# Altium schematic sheet 1_V4.schdoc
size 431 x 309 mm; Symbol: Sheet-Symbol_A4; Device: Sheet-Symbol_A4; @Page Name: V4; @Create Date: 2023-07-20; @Page Count: 1; @Page No: 1; @Project Name: openIOT传感器; @Schematic Name: V4; @Update Date: 2023-07-20; Company: 嘉立创EDA; Page Size: A4; Version: V1.0
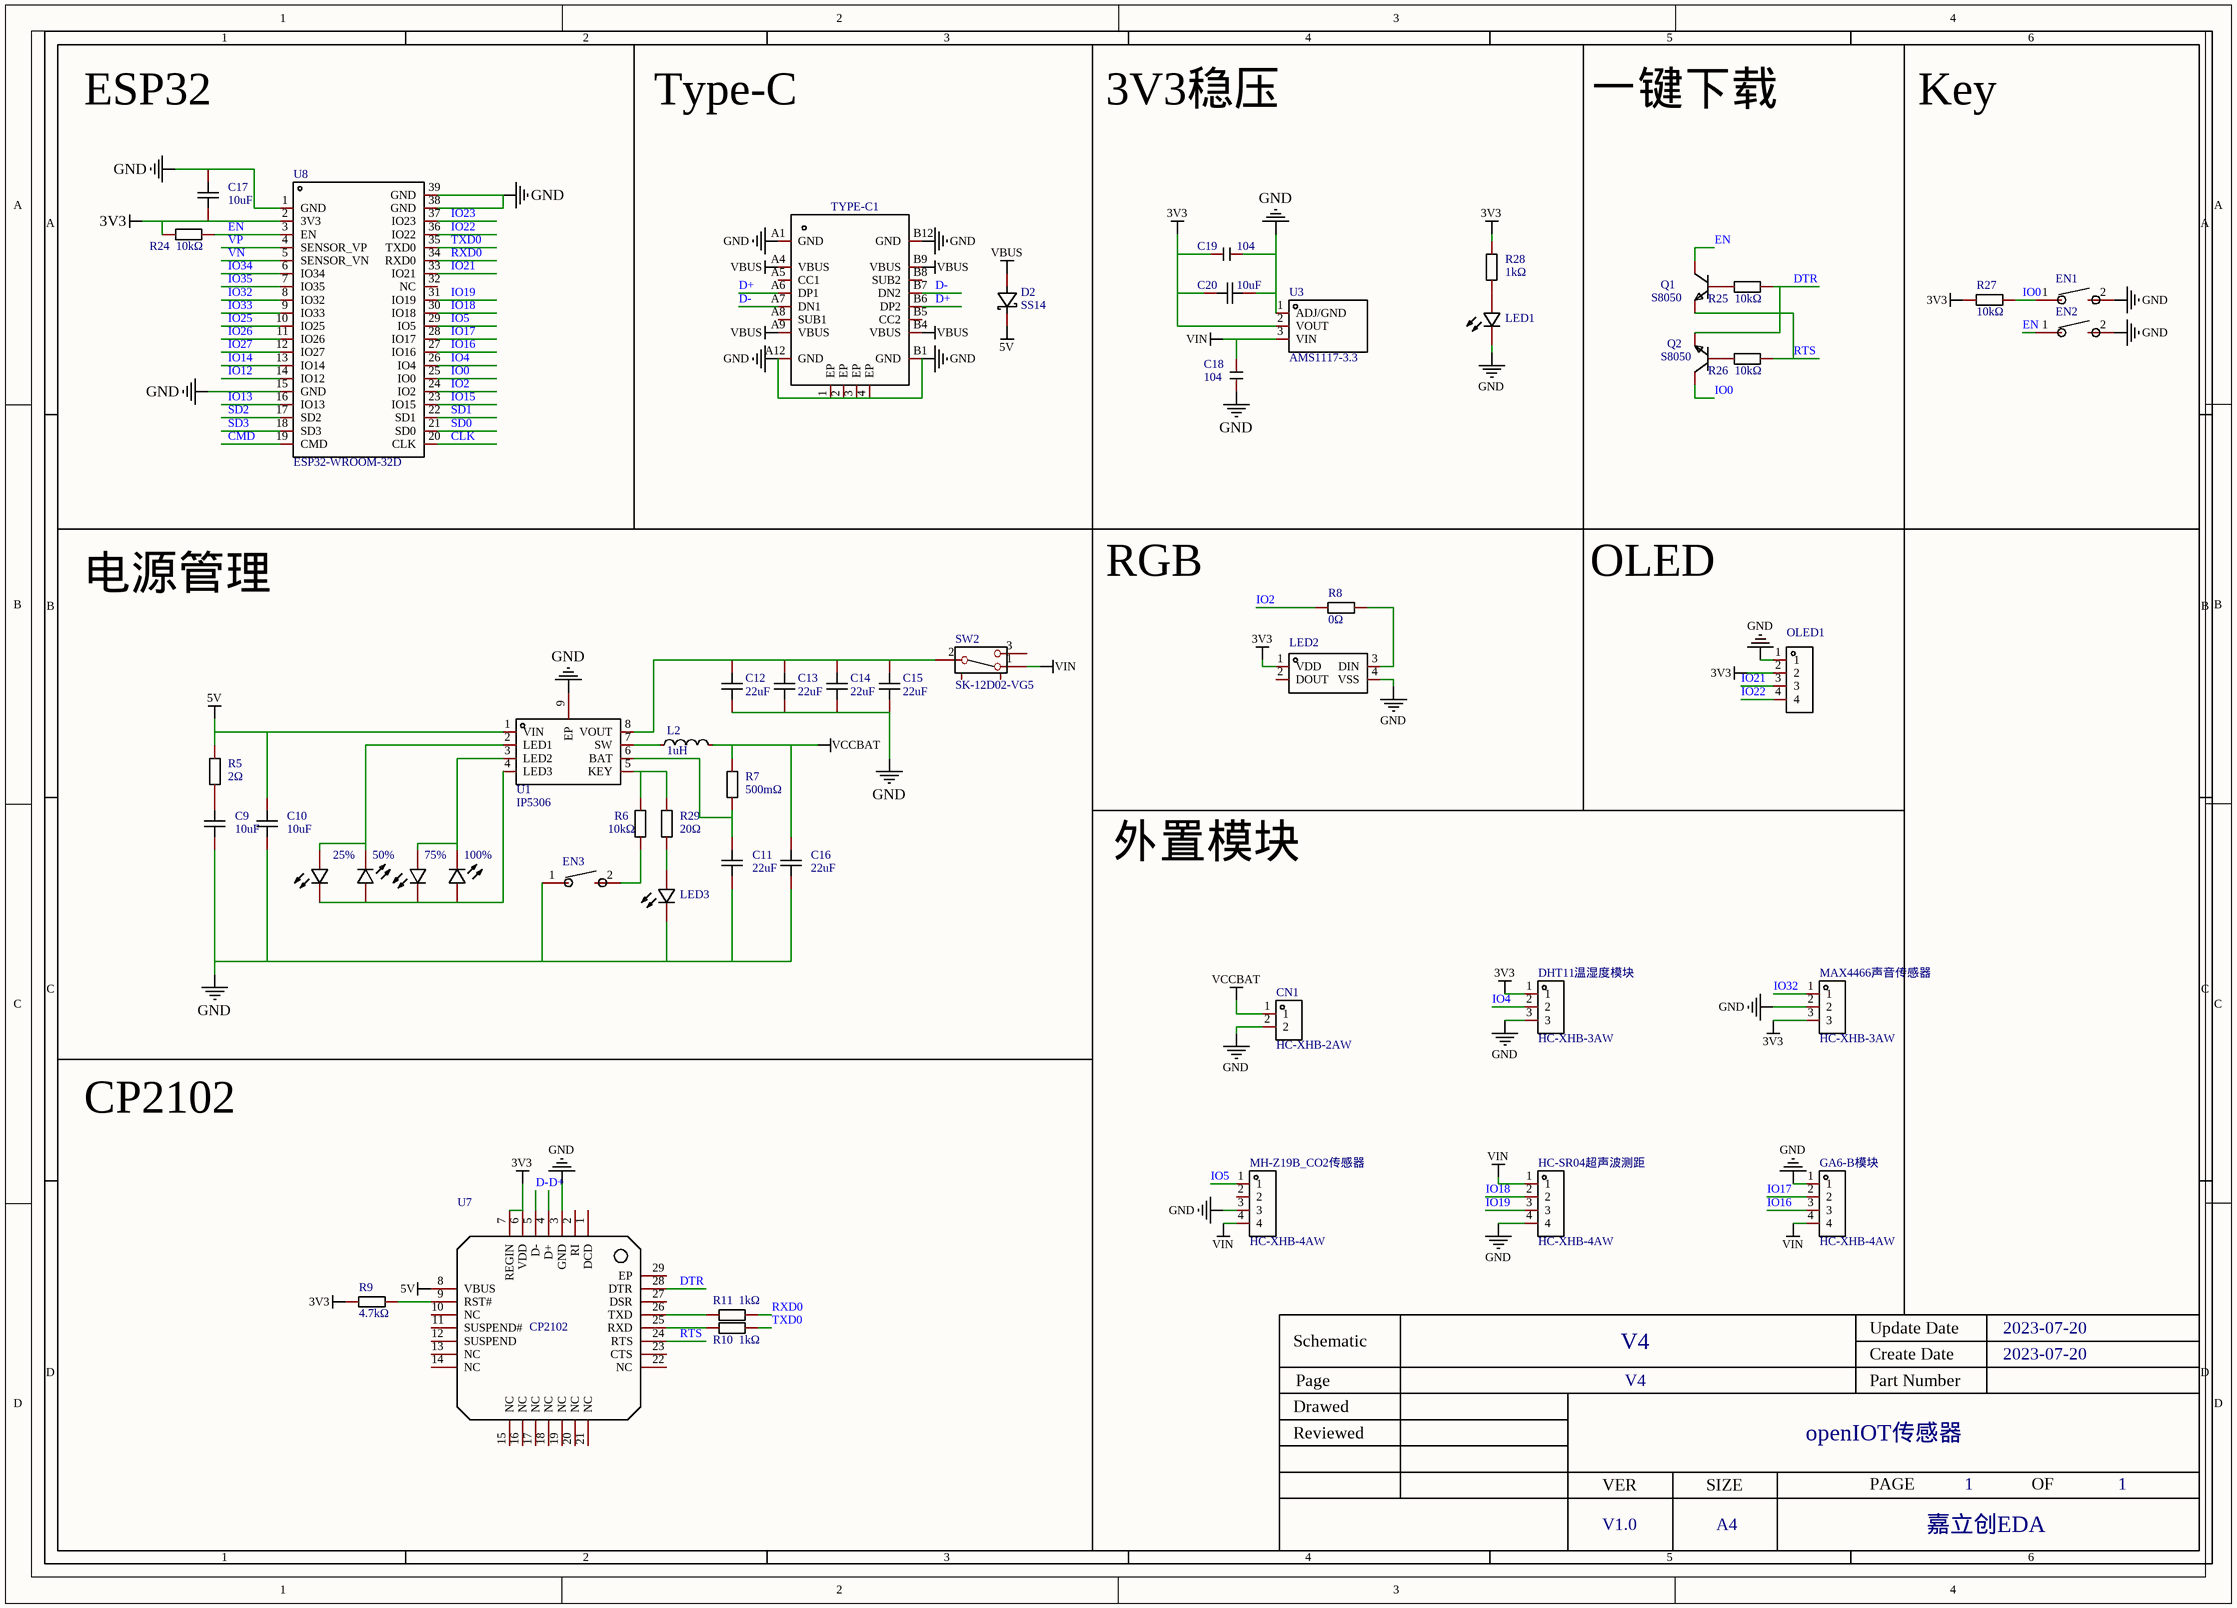
[diagram p0: 1_V4.schdoc]

## Parts
25%  19-217/GHC-YR1S2/3T  [LED0603-RD]  (value not drawn)
50%  19-217/GHC-YR1S2/3T  [LED0603-RD]  (value not drawn)
75%  19-217/GHC-YR1S2/3T  [LED0603-RD]  (value not drawn)
100%  19-217/GHC-YR1S2/3T  [LED0603-RD]  (value not drawn)
C9  10uF  [C0805]
C10  10uF  [C0805]
C11  22uF  [C1206]
C12  22uF  [C1206]
C13  22uF  [C1206]
C14  22uF  [C1206]
C15  22uF  [C1206]
C16  22uF  [C1206]
C17  10uF  [C0805]
C18  104  [C0603]
C19  104  [C0603]
C20  10uF  [C0805]
CN1  HC-XHB-2AW  [CONN-TH_2P-P2.50_HCTL_HC-XHB-2AW]
D2  SS14  [SOD-123FL_L2.8-W1.8-LS3.7-RD]
DHT11温湿度模块  HC-XHB-3AW  [CONN-TH_3P-HC-XHB-3AW]
EN1  TSA343G00-250J2  [SW-SMD_L4.0-W2.9-LS5.0]  (value not drawn)
EN2  TSA343G00-250J2  [SW-SMD_L4.0-W2.9-LS5.0]  (value not drawn)
EN3  TSA343G00-250J2  [SW-SMD_L4.0-W2.9-LS5.0]  (value not drawn)
GA6-B模块  HC-XHB-4AW  [CONN-TH_4P-P2.5_HCTL_HC-XHB-4AW]
HC-SR04超声波测距  HC-XHB-4AW  [CONN-TH_4P-P2.5_HCTL_HC-XHB-4AW]
L2  1uH  [IND-SMD_L7.0-W6.6]
LED1  19-217/GHC-YR1S2/3T  [LED0603-RD]  (value not drawn)
LED2  WS2812B-V5/W  [LED-SMD_L5.0-W5.0-P3.20-LS5.4-TL]  (value not drawn)
LED3  19-217/GHC-YR1S2/3T  [LED0603-RD]  (value not drawn)
MAX4466声音传感器  HC-XHB-3AW  [CONN-TH_3P-HC-XHB-3AW]
MH-Z19B_CO2传感器  HC-XHB-4AW  [CONN-TH_4P-P2.5_HCTL_HC-XHB-4AW]
OLED1  2.54-1*4P母  [HDR-TH_4P-P2.54-V-F]  (value not drawn)
Q1  S8050  [SOT-23-3_L2.9-W1.3-P1.90-LS2.4-BR]
Q2  S8050  [SOT-23-3_L2.9-W1.3-P1.90-LS2.4-BR]
R5  2Ω  [R0805]
R6  10kΩ  [R0805]
R7  500mΩ  [R1206]
R8  0Ω  [R0603]
R9  4.7kΩ  [R0603]
R10  1kΩ  [R0603]
R11  1kΩ  [R0603]
R24  10kΩ  [R0603]
R25  10kΩ  [R0603]
R26  10kΩ  [R0603]
R27  10kΩ  [R0603]
R28  1kΩ  [R0603]
R29  20Ω  [R0603]
SW2  SK-12D02-VG5  [SW-TH_SK-12D02-VG5]
TYPE-C1  KH-TYPE-C-16P  [USB-C-SMD_KH-TYPE-C-16P]  (value not drawn)
U1  IP5306  [ESOP-8_L4.9-W3.9-P1.27-LS6.0-BL-EP]
U3  AMS1117-3.3  [SOT-89-3_L4.5-W2.5-P1.50-LS4.2-BR]
U7  CP2102  [WQFN-28_L5.0-W5.0-P0.50-BL-EP3.2]
U8  ESP32-WROOM-32D  [WIFIM-SMD_ESP32-WROOM-32D]

## Nets
3V3: C17.1 C19.2 C20.2 DHT11温湿度模块.1 LED2.1(VDD) MAX4466声音传感器.3 OLED1.2 R9.1 R24.1 R27.2 R28.2 U3.2(VOUT) U7.6(VDD) U7.7(REGIN) U8.2(3V3)
5V: C10.2 D2.1(A) R5.2 U1.1(VIN) U7.8(VBUS)
GND: C9.1 C10.1 C11.1 C12.1 C13.1 C14.1 C15.1 C16.1 C17.2 C18.1 C19.1 C20.1 CN1.2 DHT11温湿度模块.3 EN1.2 EN2.2 EN3.1 GA6-B模块.1 HC-SR04超声波测距.4 LED1.1(C) LED2.4(VSS) LED3.1(C) MAX4466声音传感器.2 MH-Z19B_CO2传感器.3 OLED1.1 TYPE-C1.1(EP) TYPE-C1.2(EP) TYPE-C1.3(EP) TYPE-C1.4(EP) TYPE-C1.A1(GND) TYPE-C1.A12(GND) TYPE-C1.B1(GND) TYPE-C1.B12(GND) U1.9(EP) U3.1(ADJ/GND) U7.3(GND) U8.1(GND) U8.15(GND) U8.38(GND) U8.39(GND)
VBUS: D2.2(K) TYPE-C1.A4(VBUS) TYPE-C1.A9(VBUS) TYPE-C1.B4(VBUS) TYPE-C1.B9(VBUS)
VCCBAT: C16.2 CN1.1 L2.2 R7.2
VIN: C18.2 GA6-B模块.4 HC-SR04超声波测距.1 MH-Z19B_CO2传感器.4 SW2.1 U3.3(VIN)
CLK: U8.20(CLK)
CMD: U8.19(CMD)
D+: TYPE-C1.A6(DP1) TYPE-C1.B6(DP2) U7.4(D+)
D-: TYPE-C1.A7(DN1) TYPE-C1.B7(DN2) U7.5(D-)
DTR: Q2.2(E) R25.2 U7.28(DTR)
EN: EN2.1 Q1.3(C) R24.2 U8.3(EN)
IO0: EN1.1 Q2.3(C) R27.1 U8.25(IO0)
IO2: R8.2 U8.24(IO2)
IO4: DHT11温湿度模块.2 U8.26(IO4)
IO5: MH-Z19B_CO2传感器.1 U8.29(IO5)
IO12: U8.14(IO12)
IO13: U8.16(IO13)
IO14: U8.13(IO14)
IO15: U8.23(IO15)
IO16: GA6-B模块.3 U8.27(IO16)
IO17: GA6-B模块.2 U8.28(IO17)
IO18: HC-SR04超声波测距.2 U8.30(IO18)
IO19: HC-SR04超声波测距.3 U8.31(IO19)
IO21: OLED1.3 U8.33(IO21)
IO22: OLED1.4 U8.36(IO22)
IO23: U8.37(IO23)
IO25: U8.10(IO25)
IO26: U8.11(IO26)
IO27: U8.12(IO27)
IO32: MAX4466声音传感器.1 U8.8(IO32)
IO33: U8.9(IO33)
IO34: U8.6(IO34)
IO35: U8.7(IO35)
RTS: Q1.2(E) R26.2 U7.24(RTS)
RXD0: R11.2 U8.34(RXD0)
SD0: U8.21(SD0)
SD1: U8.22(SD1)
SD2: U8.17(SD2)
SD3: U8.18(SD3)
TXD0: R10.2 U8.35(TXD0)
VN: U8.5(SENSOR_VN)
VP: U8.4(SENSOR_VP)
Net25%_1: 25%.1(C) 50%.2(A) 75%.1(C) 100%.2(A) U1.4(LED3)
Net25%_2: 25%.2(A) 50%.1(C) U1.2(LED1)
Net75%_2: 75%.2(A) 100%.1(C) U1.3(LED2)
NetC9_2: C9.2 R5.1
NetC11_2: C11.2 R7.1 U1.6(BAT)
NetC12_2: C12.2 C13.2 C14.2 C15.2 SW2.2 U1.8(VOUT)
NetEN3_2: EN3.2 R6.1
NetL2_1: L2.1 U1.7(SW)
NetLED1_2: LED1.2(A) R28.1
NetLED2_3: LED2.3(DIN) R8.1
NetLED3_2: LED3.2(A) R29.1
NetQ1_1: Q1.1(B) R25.1
NetQ2_1: Q2.1(B) R26.1
NetR6_2: R6.2 R29.2 U1.5(KEY)
NetR9_2: R9.2 U7.9(RST#)
NetR10_1: R10.1 U7.25(RXD)
NetR11_1: R11.1 U7.26(TXD)

Not connected (* = marked no-connect by the designer): LED2 2(DOUT); MH-Z19B_CO2传感器 2; SW2 3 4 5; TYPE-C1 A5(CC1) A8(SUB1) B5(CC2) B8(SUB2); U7 1(DCD) 2(RI) 10(NC) 11(SUSPEND#) 12(SUSPEND) 13(NC) 14(NC) 15(NC) 16(NC) 17(NC) 18(NC) 19(NC) 20(NC) 21(NC) 22(NC) 23(CTS) 27(DSR) 29(EP); U8 32(NC)

## Notes on the sheet
- ESP32
- Type-C
- 3V3稳压
- 一键下载
- Key
- RGB
- OLED
- 电源管理
- 外置模块
- CP2102
- 1
- 2
- 3
- 4
- 5
- 6
- A
- B
- C
- D
- Schematic
- V4
- Create Date
- Update Date
- 2023-07-20
- Reviewed
- Drawed
- Page
- Part Number
- openIOT传感器
- VER
- SIZE
- PAGE
- OF
- V1.0
- A4
- 嘉立创EDA

## Library data of the parts
25% 50% 75% 100% LED1 LED3 = 19-217/GHC-YR1S2/3T: 发光颜色:翠绿;二极管配置:-;主波长:520nm~535nm;色温:-;功率:110mW;安装方式:-;; Manufacturer: EVERLIGHT(亿光); Add into BOM: yes; Emitted Color: 翠绿; Lens Color: 无色透明; Peak Wavelength: 518nm; Forward Current: 20mA; Power Dissipation: 110mW; Viewing Angle: 120°; Name: 19-217/GHC-YR1S2/3T; Symbol: 19-217/GHC-YR1S2/3T; Device: 19-217/GHC-YR1S2/3T; LCSC Part Name: 19-217/GHC-YR1S2/3T; Supplier Part: C72043; Manufacturer Part: 19-217/GHC-YR1S2/3T; Supplier Footprint: 0603; JLCPCB Part Class: Basic Part; Datasheet: https://atta.szlcsc.com/upload/public/pdf/source/20160507/1462613613780.pdf; Supplier: LCSC; Convert to PCB: yes; Diode Configuration: -; Dominant Wavelength: 520nm~535nm; Color Temperature: -; Mounting Sytle: -; Operating Temperature: -40℃~+85℃
C9 C10 C17 C20 = GRM21BR61H106KE43L: 容值:10uF;精度:±10%;额定电压:50V;材质(温度系数):X5R;; Manufacturer: muRata(村田); Add into BOM: yes; Tolerance: ±10%; Voltage Rated: 50V; Temperature Coefficient: X5R; Name: 10uF; Symbol: GRM21BR61H106KE43L; Device: GRM21BR61H106KE43L; LCSC Part Name: 10uF ±10% 50V; Supplier Part: C440198; Manufacturer Part: GRM21BR61H106KE43L; Supplier Footprint: 0805; JLCPCB Part Class: Basic Part; Datasheet: https://atta.szlcsc.com/upload/public/pdf/source/20191220/C440198_2DEA1B9834E321C8893F7972E9DFE5B0.pdf; Supplier: LCSC; Convert to PCB: yes; Value: 10uF
C11-C16 = C3216X5R1V226MTJ00E: 容值:22uF;精度:±20%;额定电压:35V;材质(温度系数):X5R;; Manufacturer: TDK; Add into BOM: yes; Tolerance: ±20%; Voltage Rated: 35V; Temperature Coefficient: X5R; Name: 22uF; Symbol: C3216X5R1V226MTJ00E; Device: C3216X5R1V226MTJ00E; LCSC Part Name: 22uF ±20% 35V; Supplier Part: C342620; Manufacturer Part: C3216X5R1V226MTJ00E; Supplier Footprint: 1206; JLCPCB Part Class: Extended Part; Datasheet: https://atta.szlcsc.com/upload/public/pdf/source/20190225/C342620_AEDAF1591EBCA53DD875EA2BBF91AE9A.pdf; Supplier: LCSC; Convert to PCB: yes; Value: 22uF
C18 C19 = 104: 3DModel: C0603_L1.6-W0.8-H0.8; BOM名称: 无极性贴片电容; 版权归属: 源创客; Add into BOM: yes; Name: 104; Symbol: 104; Device: 104; link: https://item.szlcsc.com/362304.html; 学习资源: www.ooocke.com; Convert to PCB: yes; Origin Footprint: C0603
CN1 = HC-XHB-2AW_C2845505: 参考系列:-;间距:2.5mm;插针结构:1x2P;排数:1;每排PIN数:2;行距:-;公母:公型插针;安装方式:弯插;额定电流:3A;工作温度范围:-25℃~+85℃;; Manufacturer: HCTL(华灿天禄); Add into BOM: yes; Pitch: 2.5mm; Pins Structure: 1x2P; Number of PINs Per Row: 2; Gender: 公型插针; Current Rating (Max): 3A; Name: HC-XHB-2AW; Symbol: HC-XHB-2AW; Device: HC-XHB-2AW_C2845505; LCSC Part Name: 2.54带锁扣卧式插件 2P 针座连接器线对板/线对线连接器; Supplier Part: C2845505; Manufacturer Part: HC-XHB-2AW; Supplier Footprint: 弯插,P=2.5mm; JLCPCB Part Class: Extended Part; Datasheet: https://atta.szlcsc.com/upload/public/pdf/source/20210729/C2845505_EFBF7AEAA36C6A5A1E79F7933436620E.pdf; Supplier: LCSC; Convert to PCB: yes; Reference Series: -; Number of Rows: 1; Row Spacing: -; Mounting Style: 弯插; Operating Temperature Range: -25℃~+85℃
D2 = SS14_C2909920: 二极管配置:-;直流反向耐压(Vr):40V;平均整流电流(Io):1A;正向压降(Vf):550mV@1A;反向电流(Ir):500uA@40V;; Manufacturer: KUU; Add into BOM: yes; Reverse Voltage (Vr): 40V; Average Rectified Current (Io): 1A; Name: SS14; Symbol: SS14_C2909920; Device: SS14_C2909920; LCSC Part Name: 40V 1A 550mV@1A; Supplier Part: C2909920; Manufacturer Part: SS14; Supplier Footprint: SOD-123FL; JLCPCB Part Class: Extended Part; Datasheet: https://atta.szlcsc.com/upload/public/pdf/source/20211028/6407406DF6AAB99A3E103CB6CA1E22D5.pdf; Supplier: LCSC; Convert to PCB: yes; Diode Configuration: -; Forward Voltage (Vf@If): 550mV@1A; Reverse Leakage Current (Ir): 500uA@40V
DHT11温湿度模块 MAX4466声音传感器 = HC-XHB-3AW_C2845506: 参考系列:-;间距:2.5mm;插针结构:1x3P;排数:1;每排PIN数:3;行距:-;公母:公型插针;安装方式:弯插;额定电流:3A;工作温度范围:-25℃~+85℃;; Manufacturer: HCTL(华灿天禄); Add into BOM: yes; Pitch: 2.5mm; Pins Structure: 1x3P; Number of PINs Per Row: 3; Gender: 公型插针; Current Rating (Max): 3A; Name: HC-XHB-3AW; Symbol: HC-XHB-3AW; Device: HC-XHB-3AW_C2845506; LCSC Part Name: 2.54带锁扣卧式插件 3P 针座连接器线对板/线对线连接器; Supplier Part: C2845506; Manufacturer Part: HC-XHB-3AW; Supplier Footprint: 弯插,P=2.5mm; JLCPCB Part Class: Extended Part; Datasheet: https://atta.szlcsc.com/upload/public/pdf/source/20210729/C2845505_EFBF7AEAA36C6A5A1E79F7933436620E.pdf; Supplier: LCSC; Convert to PCB: yes; Reference Series: -; Number of Rows: 1; Row Spacing: -; Mounting Style: 弯插; Operating Temperature Range: -25℃~+85℃
EN1-EN3 = TSA343G00-250J2: 触点电流:50mA;额定电压(DC):12V;绝缘电阻:100MΩ;电路结构:单刀单掷;安装方式:立贴;按钮形状:圆形按钮;按钮/盖帽颜色:黑色;带灯:无;作用力:250gf@±50gf;机械寿命:50000;工作温度:-25℃~+70℃;引脚样式:SMD接片;开关长度:3.95mm;开关宽度:2.9mm;开关高度:2mm;带支架:否;; Manufacturer: BRIGHT(博瑞泰); Add into BOM: yes; Contact Current: 50mA; Voltage Rating (DC): 12V; Insulation Resistance: 100MΩ; Circuit: 单刀单掷; Actuator Style: 圆形按钮; Actuator/Cap Color: 黑色; With Lamp: 无; Mechanical Life: 50000; Pin Style: SMD接片; Switch Length: 3.95mm; Switch Width: 2.9mm; Switch Height: 2mm; Strike Gundam: 否; Actuator Orientation: 顶部触动; 3DModel: SW-SMD_L4.0-W2.9-H2-P4.15-EH; Paste Type: expand; Origin Footprint: SW-SMD_L4.0-W2.9-P4.15-EH; Name: TSA343G00-250J2; Symbol: TSA343G00-250J2; Device: TSA343G00-250J2; LCSC Part Name: 3*4 两脚小龟不带柱  250gf; Supplier Part: C354946; Manufacturer Part: TSA343G00-250J2; Supplier Footprint: SMD; JLCPCB Part Class: Extended Part; Datasheet: https://atta.szlcsc.com/upload/public/pdf/source/20190426/C354946_6B70DFBDFA823D17B8EB46FB9599F693.pdf; Supplier: LCSC; Convert to PCB: yes; Mounting Style: 立贴; Operating Force: 250gf@±50gf; Operating Temperature: -25℃~+70℃; Illumination Color: -; link: https://item.szlcsc.com/457634.html; Assembly Type: smtWeld
GA6-B模块 HC-SR04超声波测距 MH-Z19B_CO2传感器 = HC-XHB-4AW: 参考系列:-;间距:2.5mm;插针结构:1x4P;排数:1;每排PIN数:4;行距:-;公母:公型插针;安装方式:弯插;额定电流:3A;工作温度范围:-25℃~+85℃;; Manufacturer: HCTL(华灿天禄); Add into BOM: yes; Pitch: 2.5mm; Pins Structure: 1x4P; Number of PINs Per Row: 4; Gender: 公型插针; Current Rating (Max): 3A; Name: HC-XHB-4AW; Symbol: HC-XHB-4AW; Device: HC-XHB-4AW; LCSC Part Name: 2.54带锁扣卧式插件 4P 针座连接器线对板/线对线连接器; Supplier Part: C2845507; Manufacturer Part: HC-XHB-4AW; Supplier Footprint: 弯插,P=2.5mm; JLCPCB Part Class: Extended Part; Datasheet: https://atta.szlcsc.com/upload/public/pdf/source/20210729/C2845505_EFBF7AEAA36C6A5A1E79F7933436620E.pdf; Supplier: LCSC; Convert to PCB: yes; Reference Series: -; Number of Rows: 1; Row Spacing: -; Mounting Style: 弯插; Operating Temperature Range: -25℃~+85℃
L2 = FXL0618-1R0-M: 电感值:1uH;精度:±20%;额定电流:8.5A;饱和电流(Isat):14A;; Manufacturer: cjiang(长江微电); Add into BOM: yes; Tolerance: ±20%; Rated Current: 8.5A; Saturation Current (Isat): 14A; DC Resistance (DCR): 13mΩ; Name: 1uH; Symbol: FXL0618-1R0-M; Device: FXL0618-1R0-M; LCSC Part Name: 1uH ±20% 8.5A 13mΩ; Supplier Part: C524591; Manufacturer Part: FXL0618-1R0-M; Supplier Footprint: SMD,6.6x7mm; JLCPCB Part Class: Extended Part; Datasheet: https://atta.szlcsc.com/upload/public/pdf/source/20200117/C485363_A2440626DC7482D75DD0DD56D1883FBF.pdf; Supplier: LCSC; Convert to PCB: yes; Value: 1uH
LED2 = WS2812B-V5/W: Manufacturer: worldsemi; Add into BOM: yes; Name: WS2812B-V5/W; Symbol: WS2812B-V5/W; Device: WS2812B-V5/W; LCSC Part Name: RGB三色 （注意防潮，请查阅规格书中对应具体内容）; Supplier Part: C2874885; Manufacturer Part: WS2812B-V5/W; Supplier Footprint: 5050(mm); JLCPCB Part Class: 扩展库; Datasheet: https://atta.szlcsc.com/upload/public/pdf/source/20220607/7C249E7978D02183621563743847A955.pdf; Supplier: LCSC; Convert to PCB: yes; NO_CONNECT: yes
OLED1 = 2.54-1*4P母: 排数:单排;总孔位数:4;间距:2.54mm;插孔结构:1x4P;行距:-;安装类型:直插;圆孔/方孔:方孔;额定电流:3A;额定电压:-;插孔方向:顶部;塑高:-;触头材质:青铜;触头镀层:-;工作温度范围:-40℃~+105℃;焊接温度(最大值):-;; Manufacturer: BOOMELE(博穆精密); Add into BOM: yes; Number of Holes: 4; Pitch: 2.54mm; Holes Structure: 1x4P; Circular Hole / Square Hole: 方孔; Current Rating (Max): 3A; Holes Direction: 顶部; Name: 2.54-1*4P母; Symbol: 2.54-1*4P母; Device: 2.54-1*4P母; LCSC Part Name: 2.54mm 1x4P; Supplier Part: C2718488; Manufacturer Part: 2.54-1*4P母; Supplier Footprint: 插件,P=2.54mm; JLCPCB Part Class: Extended Part; Datasheet: https://atta.szlcsc.com/upload/public/pdf/source/20210301/C2718488_F4427B881E42CAA8DDB0B1C12B3A522C.pdf; Supplier: LCSC; Convert to PCB: yes; Number of Rows: 单排; Row Spacing: -; Mounting Type: 直插; Voltage Rating (Max): -; Insulation Height: -; Contact Material: 青铜; Contact Plating: -; Operating Temperature Range: -40℃~+105℃; Welding Temperature (Max): -
Q1 Q2 = S8050: Manufacturer: WPMtek(维攀微); 3DModel: SOT-23-3P_L2.9-W1.3-H1.0-LS2.4-P0.95; Add into BOM: yes; Name: S8050; Symbol: S8050; Device: S8050; link: https://www.diodes.com/assets/Package-Files/SOT23.pdf; Supplier: LCSC; Supplier Part: C2688231; Manufacturer Part: S8050; Convert to PCB: yes; Origin Footprint: SOT-23-3_L2.9-W1.3-P1.90-LS2.4-BR
R5 = 0805W8F200KT5E: 电阻类型:厚膜电阻;阻值:2Ω;精度:±1%;功率:125mW;; Manufacturer: UNI-ROYAL(厚声); Add into BOM: yes; Tolerance: ±1%; Power(Watts): 125mW; Temperature Coefficient: ±400ppm/℃; Overload Voltage (Max): 150V; Name: 2Ω; Symbol: 0805W8F200KT5E; Device: 0805W8F200KT5E; LCSC Part Name: 2Ω ±1% 125mW; Supplier Part: C17606; Manufacturer Part: 0805W8F200KT5E; Supplier Footprint: 0805; JLCPCB Part Class: Basic Part; Datasheet: https://atta.szlcsc.com/upload/public/pdf/source/20200306/C422600_1E6D84923E4A46A82E41ADD87F860B5C.pdf; Supplier: LCSC; Convert to PCB: yes; Type: 厚膜电阻; Value: 2Ω; Operating Temperature Range: -55℃~+155℃
R6 = 0805W8F1002T5E_C17414: 电阻类型:厚膜电阻;阻值:10kΩ;精度:±1%;功率:125mW;; Manufacturer: UNI-ROYAL(厚声); Add into BOM: yes; Tolerance: ±1%; Power(Watts): 125mW; Temperature Coefficient: ±100ppm/℃; Overload Voltage (Max): 150V; Name: 10kΩ; Symbol: 0805W8F1002T5E; Device: 0805W8F1002T5E_C17414; LCSC Part Name: 10kΩ ±1% 125mW; Supplier Part: C17414; Manufacturer Part: 0805W8F1002T5E; Supplier Footprint: 0805; JLCPCB Part Class: Basic Part; Datasheet: https://atta.szlcsc.com/upload/public/pdf/source/20200306/C422600_1E6D84923E4A46A82E41ADD87F860B5C.pdf; Supplier: LCSC; Convert to PCB: yes; Type: 厚膜电阻; Value: 10kΩ; Operating Temperature Range: -55℃~+155℃
R7 = 1206W4F500LT5E: 电阻类型:厚膜电阻;阻值:500mΩ;精度:±1%;功率:250mW;; Manufacturer: UNI-ROYAL(厚声); Add into BOM: yes; Tolerance: ±1%; Power(Watts): 250mW; Temperature Coefficient: ±800ppm/℃; Overload Voltage (Max): 200V; Name: 500mΩ; Symbol: 1206W4F500LT5E; Device: 1206W4F500LT5E; LCSC Part Name: 500mΩ ±1% 250mW; Supplier Part: C25340; Manufacturer Part: 1206W4F500LT5E; Supplier Footprint: 1206; JLCPCB Part Class: Extended Part; Datasheet: https://atta.szlcsc.com/upload/public/pdf/source/20200306/C422600_1E6D84923E4A46A82E41ADD87F860B5C.pdf; Supplier: LCSC; Convert to PCB: yes; Type: 厚膜电阻; Value: 500mΩ; Operating Temperature Range: -55℃~+155℃
R8 = 0603WAF0000T5E: 电阻类型:厚膜电阻;阻值:0Ω;精度:±1%;功率:100mW;最大工作电压:75V;工作温度范围:-55℃~+155℃;; Manufacturer: UNI-ROYAL(厚声); Add into BOM: yes; Tolerance: ±1%; Power(Watts): 100mW; Overload Voltage (Max): 75V; Name: 0Ω; Symbol: 0603WAF0000T5E; Device: 0603WAF0000T5E; LCSC Part Name: 0Ω ±1% 100mW; Supplier Part: C21189; Manufacturer Part: 0603WAF0000T5E; Supplier Footprint: 0603; JLCPCB Part Class: Basic Part; Datasheet: https://atta.szlcsc.com/upload/public/pdf/source/20200306/C422600_1E6D84923E4A46A82E41ADD87F860B5C.pdf; Supplier: LCSC; Convert to PCB: yes; Type: 厚膜电阻; Value: 0Ω; Operating Temperature Range: -55℃~+155℃
R9 = 0603WAF4701T5E: 电阻类型:厚膜电阻;阻值:4.7kΩ;精度:±1%;功率:100mW;; Manufacturer: UNI-ROYAL(厚声); Add into BOM: yes; Tolerance: ±1%; Power(Watts): 100mW; Temperature Coefficient: ±100ppm/℃; Overload Voltage (Max): 75V; Name: 4.7kΩ; Symbol: 0603WAF4701T5E; Device: 0603WAF4701T5E; LCSC Part Name: 4.7kΩ ±1% 100mW; Supplier Part: C23162; Manufacturer Part: 0603WAF4701T5E; Supplier Footprint: 0603; JLCPCB Part Class: Basic Part; Datasheet: https://atta.szlcsc.com/upload/public/pdf/source/20200306/C422600_1E6D84923E4A46A82E41ADD87F860B5C.pdf; Supplier: LCSC; Convert to PCB: yes; Type: 厚膜电阻; Value: 4.7kΩ; Operating Temperature Range: -55℃~+155℃
R10 R11 R28 = 0603WAF1001T5E: 电阻类型:厚膜电阻;阻值:1kΩ;精度:±1%;功率:100mW;; Manufacturer: UNI-ROYAL(厚声); Add into BOM: yes; Tolerance: ±1%; Power(Watts): 100mW; Temperature Coefficient: ±100ppm/℃; Overload Voltage (Max): 75V; Name: 1kΩ; Symbol: 0603WAF1001T5E; Device: 0603WAF1001T5E; LCSC Part Name: 1kΩ ±1% 100mW; Supplier Part: C21190; Manufacturer Part: 0603WAF1001T5E; Supplier Footprint: 0603; JLCPCB Part Class: Basic Part; Datasheet: https://atta.szlcsc.com/upload/public/pdf/source/20200306/C422600_1E6D84923E4A46A82E41ADD87F860B5C.pdf; Supplier: LCSC; Convert to PCB: yes; Type: 厚膜电阻; Value: 1kΩ; Operating Temperature Range: -55℃~+155℃
R24-R27 = 0603WAF1002T5E: 电阻类型:厚膜电阻;阻值:10kΩ;精度:±1%;功率:100mW;; Manufacturer: UNI-ROYAL(厚声); Add into BOM: yes; Tolerance: ±1%; Power(Watts): 100mW; Temperature Coefficient: ±100ppm/℃; Overload Voltage (Max): 75V; Name: 10kΩ; Symbol: 0603WAF1002T5E; Device: 0603WAF1002T5E; LCSC Part Name: 厚膜电阻 10kΩ ±1% 100mW; Supplier Part: C25804; Manufacturer Part: 0603WAF1002T5E; Supplier Footprint: 0603; JLCPCB Part Class: Basic Part; Datasheet: https://atta.szlcsc.com/upload/public/pdf/source/20200306/C422600_1E6D84923E4A46A82E41ADD87F860B5C.pdf; Supplier: LCSC; Convert to PCB: yes; Type: 厚膜电阻; Value: 10kΩ; Operating Temperature Range: -55℃~+155℃
R29 = 0603WAF200JT5E: 电阻类型:厚膜电阻;阻值:20Ω;精度:±1%;功率:100mW;; Manufacturer: UNI-ROYAL(厚声); Add into BOM: yes; Tolerance: ±1%; Power(Watts): 100mW; Temperature Coefficient: ±100ppm/℃; Overload Voltage (Max): 75V; Name: 20Ω; Symbol: 0603WAF200JT5E; Device: 0603WAF200JT5E; LCSC Part Name: 20Ω ±1% 100mW; Supplier Part: C22950; Manufacturer Part: 0603WAF200JT5E; Supplier Footprint: 0603; JLCPCB Part Class: Basic Part; Datasheet: https://atta.szlcsc.com/upload/public/pdf/source/20200306/C422600_1E6D84923E4A46A82E41ADD87F860B5C.pdf; Supplier: LCSC; Convert to PCB: yes; Type: 厚膜电阻; Value: 20Ω; Operating Temperature Range: -55℃~+155℃
SW2 = SK-12D02-VG5_C136722: 额定电流(DC):-;额定电压(DC):-;额定电流(AC):-;额定电压(AC):-;电路结构:单刀双掷;安装方式:卧插;机械寿命:5000;滑钮形状:矩形柱状;引脚样式:PC引脚;工作温度:-25℃~+70℃;开关高度:9.5mm;; Manufacturer: 韩国韩荣; Add into BOM: yes; Circuit: 单刀双掷; Mechanical Life: 5000; Actuator Style: 矩形柱状; Pin Style: PC引脚; Switch Height: 9.5mm; Name: SK-12D02-VG5; Symbol: SK-12D02-VG5; Device: SK-12D02-VG5_C136722; LCSC Part Name: SK-12D02-VG5; Supplier Part: C136722; Manufacturer Part: SK-12D02-VG5; Supplier Footprint: 插件; JLCPCB Part Class: Extended Part; Datasheet: https://atta.szlcsc.com/upload/public/pdf/source/20180731/C136723_39114FC09BF2E9DC98823B78B7234B45.pdf; Supplier: LCSC; Convert to PCB: yes; Current Rating (DC): -; Voltage Rating (DC): -; Current Rating (AC): -; Voltage Rating (AC): -; Mounting Style: 卧插; Operating Temperature: -25℃~+70℃
TYPE-C1 = KH-TYPE-C-16P: 连接器类型:Type-C;标准:-;公母:母座;触点数量:16;端口数量:1;安装方式:卧贴;额定电流 - 电源:3A;工作温度范围:-40℃~+85℃;; Manufacturer: kinghelm(金航标); Add into BOM: yes; Connector Type: Type-C; Gender: 母座; Number of Contacts: 16; Number of Ports: 1; Current Rating - Power (Max): 3A; Name: KH-TYPE-C-16P; Symbol: KH-TYPE-C-16P; Device: KH-TYPE-C-16P; LCSC Part Name: Type-C 母座 卧贴; Supplier Part: C709357; Manufacturer Part: KH-TYPE-C-16P; Supplier Footprint: SMD; JLCPCB Part Class: Extended Part; Datasheet: https://atta.szlcsc.com/upload/public/pdf/source/20200911/C709357_AA8DCEB38BB20E3035A7ED7AE7667837.pdf; Supplier: LCSC; Convert to PCB: yes; Standard: -; Mounting Style: 卧贴; Operating Temperature Range: -40℃~+85℃; NO_CONNECT: yes
U1 = IP5306: 2.1A充电2.4A放电高集成度移动电源SOC; Manufacturer: INJOINIC(英集芯); Add into BOM: yes; Name: IP5306; Symbol: IP5306; Device: IP5306; LCSC Part Name: IP5306; Supplier Part: C181692; Manufacturer Part: IP5306; Supplier Footprint: ESOP-8; JLCPCB Part Class: Extended Part; Datasheet: https://atta.szlcsc.com/upload/public/pdf/source/20180920/C181692_842C9BF636DF123BB66E91FC1AD6F13F.pdf; Supplier: LCSC; Convert to PCB: yes
U3 = AMS1117-3.3_C880752: 输出类型:-;; Manufacturer: Slkor(萨科微); Add into BOM: yes; Name: AMS1117-3.3; Symbol: AMS1117-3.3_C880752; Device: AMS1117-3.3_C880752; LCSC Part Name: AMS1117-3.3; Supplier Part: C880752; Manufacturer Part: AMS1117-3.3; Supplier Footprint: SOT-89-3; JLCPCB Part Class: Extended Part; Datasheet: https://atta.szlcsc.com/upload/public/pdf/source/20201231/C426566_7F22DB93439D00F3FA27143E4F28C6AA.pdf; Supplier: LCSC; Convert to PCB: yes; Output Type: -
U7 = CP2102-GMR: 类型:Transceiver;协议类别:USB;驱动器/接收器数:1/1;数据速率:1Mbps;; Manufacturer: SILICON LABS(芯科); Add into BOM: yes; Protocol: USB; Number of Drivers/Receivers: 1/1; Data Rate: 1Mbps; Supply Voltage: 3V ~ 3.6V; Name: CP2102; Symbol: CP2102-GMR; Device: CP2102-GMR; LCSC Part Name: CP2102-GMR; Supplier Part: C6568; Manufacturer Part: CP2102; Supplier Footprint: QFN-28(5x5); JLCPCB Part Class: Basic Part; Datasheet: https://atta.szlcsc.com/upload/public/pdf/source/20170103/1483439882795.pdf; Supplier: LCSC; Convert to PCB: yes; Type: Transceiver; NO_CONNECT: yes
U8 = ESP32-WROOM-32D: Symbol: ESP32-WROOM-32D_C503588; Add into BOM: yes; Name: ESP32-WROOM-32D; Device: ESP32-WROOM-32D; LCSC Part Name: ESP32-WROOM-32D; Supplier Part: C503588; Manufacturer Part: ESP32-WROOM-32D; Supplier Footprint: Module; JLCPCB Part Class: Extended Part; Datasheet: https://atta.szlcsc.com/upload/public/pdf/source/20200407/C503588_9E920733859C3E86D4243CAB277EC877.pdf; Supplier: LCSC; Convert to PCB: yes; NO_CONNECT: yes